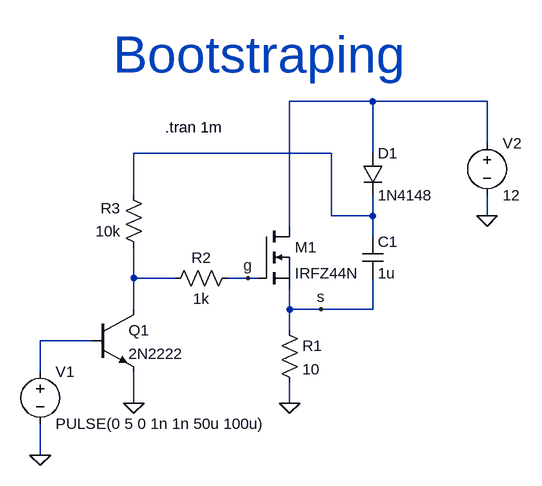
[diagram p0: schematic mosfet-bootstraping.asc]
mosfet-bootstraping.asc, the LTspice schematic file:
Version 4
SHEET 1 928 680
WIRE 592 -48 464 -48
WIRE 768 -48 592 -48
WIRE 768 16 768 -48
WIRE 528 32 224 32
WIRE 592 32 592 -48
WIRE 224 96 224 32
WIRE 528 128 528 32
WIRE 592 128 592 96
WIRE 592 128 528 128
WIRE 768 128 768 96
WIRE 464 144 464 -48
WIRE 592 160 592 128
WIRE 224 224 224 176
WIRE 288 224 224 224
WIRE 400 224 368 224
WIRE 416 224 400 224
WIRE 224 272 224 224
WIRE 464 272 464 240
WIRE 512 272 464 272
WIRE 592 272 592 224
WIRE 592 272 512 272
WIRE 464 304 464 272
WIRE 160 320 80 320
WIRE 80 368 80 320
WIRE 224 416 224 368
WIRE 464 416 464 384
WIRE 80 496 80 448
FLAG 464 416 0
FLAG 224 416 0
FLAG 768 128 0
FLAG 80 496 0
FLAG 400 224 g
FLAG 512 272 s
SYMBOL nmos 416 144 R0
SYMATTR InstName M1
SYMATTR Value IRFZ44N
SYMBOL Res 448 288 R0
SYMATTR InstName R1
SYMATTR Value 10
SYMBOL Res 384 208 R90
WINDOW 0 0 56 VBottom 2
WINDOW 3 32 56 VTop 2
SYMATTR InstName R2
SYMATTR Value 1k
SYMBOL Res 240 192 R180
WINDOW 0 36 76 Left 2
WINDOW 3 36 40 Left 2
SYMATTR InstName R3
SYMATTR Value 10k
SYMBOL npn 160 272 R0
SYMATTR InstName Q1
SYMATTR Value 2N2222
SYMBOL Cap 576 160 R0
SYMATTR InstName C1
SYMATTR Value 1u
SYMBOL diode 576 32 R0
SYMATTR InstName D1
SYMATTR Value 1N4148
SYMBOL voltage 80 352 R0
SYMATTR InstName V1
SYMATTR Value PULSE(0 5 0 1n 1n 50u 100u)
SYMBOL voltage 768 0 R0
SYMATTR InstName V2
SYMATTR Value 12
TEXT 272 -8 Left 2 !.tran 1m
TEXT 192 -120 Left 6 ;Bootstraping

The netlist it stands for:
* mosfet-bootstraping.asc
M1 N001 g s s IRFZ44N
R1 s 0 10
R2 g N003 1k
R3 N003 N002 10k
Q1 N003 N004 0 0 2N2222
C1 N002 s 1u
D1 N001 N002 1N4148
V1 N004 0 PULSE(0 5 0 1n 1n 50u 100u)
V2 N001 0 12
.model D D
.lib standard.dio
.model NPN NPN
.model PNP PNP
.lib standard.bjt
.model NMOS NMOS
.model PMOS PMOS
.lib standard.mos
.tran 1m
* Bootstraping
.backanno
.end